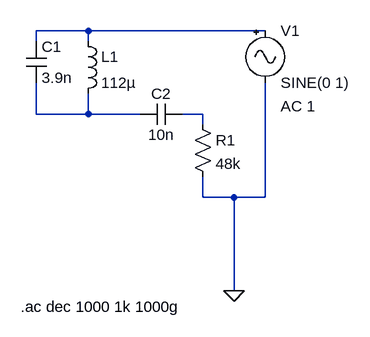
[diagram p0: schematic RessonanceTest.asc]
RessonanceTest.asc, the LTspice schematic file:
Version 4
SHEET 1 880 680
WIRE 160 64 80 64
WIRE 432 64 160 64
WIRE 80 80 80 64
WIRE 160 80 160 64
WIRE 80 192 80 144
WIRE 160 192 160 160
WIRE 160 192 80 192
WIRE 240 192 160 192
WIRE 336 192 304 192
WIRE 336 208 336 192
WIRE 336 320 336 288
WIRE 384 320 336 320
WIRE 432 320 432 144
WIRE 432 320 384 320
WIRE 384 464 384 320
FLAG 384 464 0
SYMBOL cap 64 80 R0
SYMATTR InstName C1
SYMATTR Value 3.9n
SYMBOL ind 144 64 R0
SYMATTR InstName L1
SYMATTR Value 112µ
SYMBOL cap 304 176 R90
WINDOW 0 0 32 VBottom 2
WINDOW 3 32 32 VTop 2
SYMATTR InstName C2
SYMATTR Value 10n
SYMBOL res 320 192 R0
SYMATTR InstName R1
SYMATTR Value 48k
SYMBOL Misc\\signal 432 48 R0
WINDOW 123 24 132 Left 2
WINDOW 39 0 0 Left 0
SYMATTR InstName V1
SYMATTR Value SINE(0 1)
SYMATTR Value2 AC 1
TEXT 56 488 Left 2 !.ac dec 1000 1k 1000g

The netlist it stands for:
* RessonanceTest.asc
C1 N001 N002 3.9n
L1 N001 N002 112µ
C2 N003 N002 10n
R1 N003 0 48k
V1 N001 0 SINE(0 1) AC 1
.ac dec 1000 1k 1000g
.backanno
.end